# EAGLE schematic ARDUINO RADYO VE AMFI (EAGLE 9.6.2)
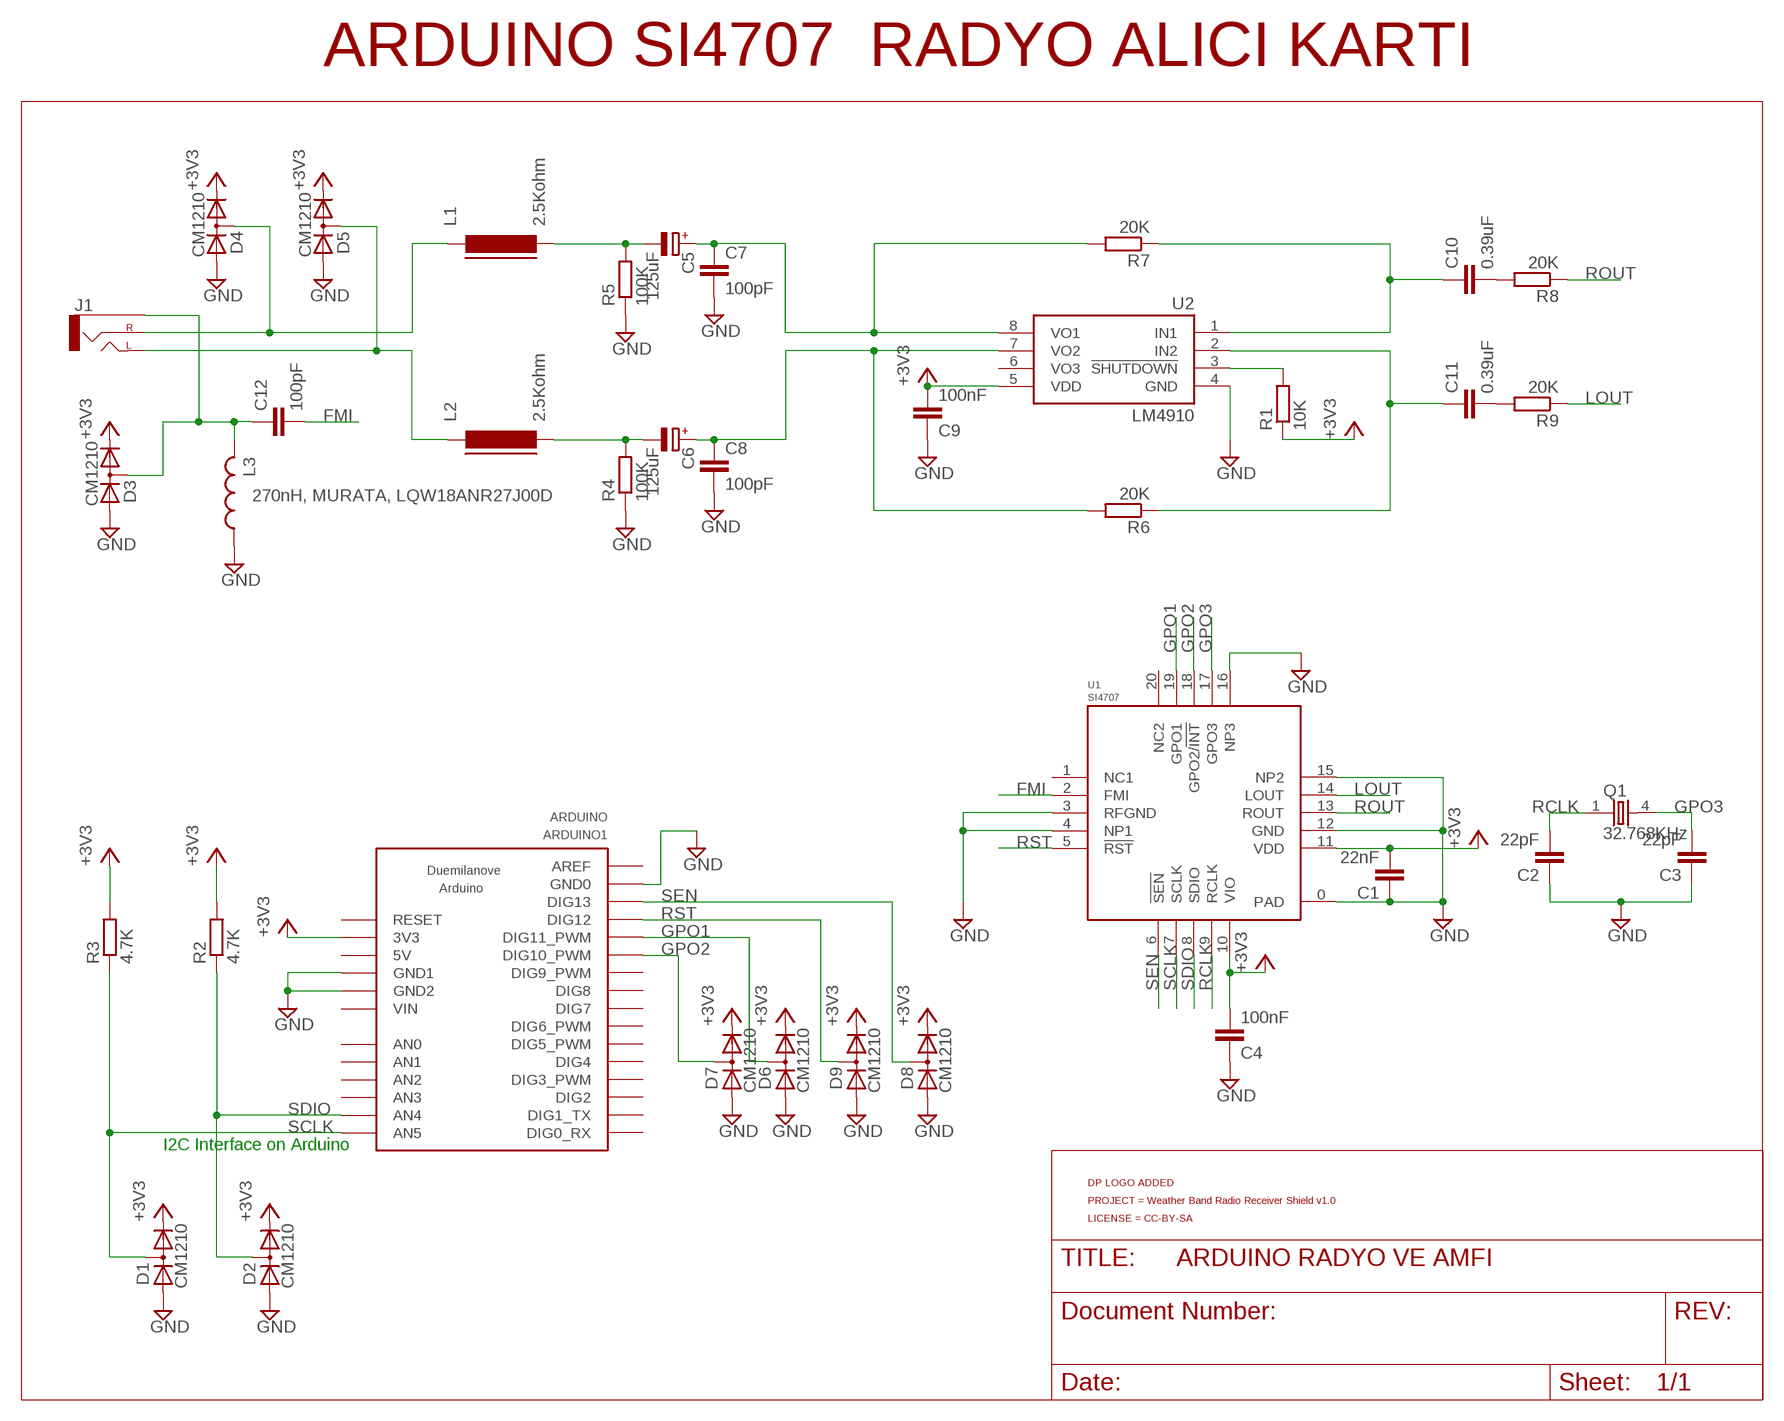
[diagram p0: schematic, sheet 1]

## Parts
ARDUINO1  ARDUINO  [ARDUINO]
C1  22nF  CAPC603  [C603]
C2  22pF  CAPC603  [C603]
C3  22pF  CAPC603  [C603]
C4  100nF  CAPC603  [C603]
C5  125uF  CAP_POLSMC_B  [SMC_B]
C6  125uF  CAP_POLSMC_B  [SMC_B]
C7  100pF  CAPC603  [C603]
C8  100pF  CAPC603  [C603]
C9  100nF  CAPC603  [C603]
C10  0.39uF  CAPC603  [C603]
C11  0.39uF  CAPC603  [C603]
C12  100pF  CAPC603  [C603]
D1  CM1210  [SOT23]
D2  CM1210  [SOT23]
D3  CM1210  [SOT23]
D4  CM1210  [SOT23]
D5  CM1210  [SOT23]
D6  CM1210  [SOT23]
D7  CM1210  [SOT23]
D8  CM1210  [SOT23]
D9  CM1210  [SOT23]
J1  AUDIO-JACKSMD  [STEREOJACK2.5MM_SMD]
L1  2.5Kohm  FERRITE_BEAD603  [FB603]
L2  2.5Kohm  FERRITE_BEAD603  [FB603]
L3  270nH, MURATA, LQW18ANR27J00D  L-USL2012C  [L2012C]
Q1  32.768KHz  86SMX  [86SMX]
R1  10K  RESISTORR603  [R603]
R2  4.7K  RESISTORR603  [R603]
R3  4.7K  RESISTORR603  [R603]
R4  100K  RESISTORR603  [R603]
R5  100K  RESISTORR603  [R603]
R6  20K  RESISTORR603  [R603]
R7  20K  RESISTORR603  [R603]
R8  20K  RESISTORR603  [R603]
R9  20K  RESISTORR603  [R603]
U1  SI4707  [QFN-20]
U2  LM4910  [SO8]
U$1  DP_LOGO  [DP_LOGO]

## Nets
FMI: C12.2 U1.2(FMI)
GND: ARDUINO1.GND0 ARDUINO1.GND1 ARDUINO1.GND2 C1.1 C2.1 C3.1 C4.1 C7.2 C8.2 C9.1 D1.3(A) D2.3(A) D3.3(A) D4.3(A) D5.3(A) D6.3(A) D7.3(A) D8.3(A) D9.3(A) L3.1 R4.1 R5.1 U1.0(PAD) U1.3(RFGND) U1.4(NP1) U1.12(GND) U1.15(NP2) U1.16(NP3) U2.4(GND)
GPO1: ARDUINO1.D_11(DIG11_PWM) D6.1(AC) U1.19(GPO1)
GPO2: ARDUINO1.D_10(DIG10_PWM) D7.1(AC) U1.18(GPO2/!INT)
GPO3: C3.2 Q1.4 U1.17(GPO3)
LOUT: R9.1 U1.14(LOUT)
N$1: C5.+ C7.1 R7.2 U2.8(VO1)
N$3: D4.1(AC) J1.4(RIGHT) L1.1
N$4: C6.- L2.2 R4.2
N$5: C5.- L1.2 R5.2
N$6: C6.+ C8.1 R6.2 U2.7(VO2)
N$7: R1.2 U2.3(!SHUTDOWN)
N$8: C11.1 R6.1 U2.2(IN2)
N$9: C10.1 R7.1 U2.1(IN1)
N$10: C10.2 R8.2
N$11: C11.2 R9.2
N$12: C12.1 D3.1(AC) J1.5(SLEEVE) L3.2
N$15: D5.1(AC) J1.1(LEFT) L2.1
RCLK: C2.2 Q1.1 U1.9(RCLK)
ROUT: R8.1 U1.13(ROUT)
RST: ARDUINO1.D_12(DIG12) D9.1(AC) U1.5(!RST)
SCLK: ARDUINO1.A_5(AN5) D1.1(AC) R3.1 U1.7(SCLK)
SDIO: ARDUINO1.A_4(AN4) D2.1(AC) R2.1 U1.8(SDIO)
SEN: ARDUINO1.D_13(DIG13) D8.1(AC) U1.6(!SEN)
VCC: ARDUINO1.3V3 C1.2 C4.2 C9.2 D1.2(C) D2.2(C) D3.2(C) D4.2(C) D5.2(C) D6.2(C) D7.2(C) D8.2(C) D9.2(C) R1.1 R2.2 R3.2 U1.10(VIO) U1.11(VDD) U2.5(VDD) ; supply symbol labelled +3V3
Unconnected: ARDUINO1.5V ARDUINO1.A_0(AN0) ARDUINO1.A_1(AN1) ARDUINO1.A_2(AN2) ARDUINO1.A_3(AN3) ARDUINO1.AREF ARDUINO1.D_0(DIG0_RX) ARDUINO1.D_1(DIG1_TX) ARDUINO1.D_2(DIG2) ARDUINO1.D_3(DIG3_PWM) ARDUINO1.D_4(DIG4) ARDUINO1.D_5(DIG5_PWM) ARDUINO1.D_6(DIG6_PWM) ARDUINO1.D_7(DIG7) ARDUINO1.D_8(DIG8) ARDUINO1.D_9(DIG9_PWM) ARDUINO1.RESET U1.1(NC1) U1.20(NC2) U2.6(VO3)

## Notes on the sheet
- ARDUINO SI4707  RADYO ALICI KARTI
- I2C Interface on Arduino

## Power pins joined to a net without a drawn wire
VIN: ARDUINO1.VIN

## Library data of the parts
ARDUINO1 = dp_devices:ARDUINO
C1-C4 C7-C12 = dp_devices:CAP
C5 C6 = dp_devices:CAP_POL
D1-D9 = diode:CM1210
J1 = SparkFun:AUDIO-JACK: 3.5mm Audio Jack Simple 3.5mm common PCB mount audio jack. SKU: PRT-08032
L1 L2 = dp_devices:FERRITE_BEAD
L3 = rcl:L-US: INDUCTOR, American symbol
Q1 = crystal:86SMX: CRYSTAL; MF: C-MAC FREQUENCY PRODUCTS LTD; MPN: XTAL003321- 86SMX; OC_FARNELL: 6344914; OC_NEWARK: 01H9866
R1-R9 = dp_devices:RESISTOR
U1 = dp_devices:SI4707
U2 = dp_devices:LM4910
U$1 = dp_devices:DP_LOGO; FF1: fullfillment by; FF2: Seeed studio; FF3: www.seeedstudio.com; LICENSE: CC-BY-SA; PROJECT: Weather Band Radio Receiver Shield v1.0; URL1: http://; URL2: DangerousPrototypes.com